# Altium schematic sheet FIT_TCM_LOGIC.SchDoc: FIT_PM12 board
size 420 x 297 mm; CheckedBy: G.Kasprowicz; Author: INR Moscow; CompanyName: WUT ISE; DrawnBy: M.Podgórski; Organization: WUT ISE; Address1: PW ISE; Address2: Nowowiejska 15/19 00-665 Warsaw; Address3: gkasprow@gmail.com; Revision: 2; SheetNumber: -; SheetTotal: -; ModifiedBy: -; CheckedDate: -; Title2: Title 2; DivGrp: WUT ISE; Designer: INR RAS; ModifiedDate: -; ProjectName: Sensor Box
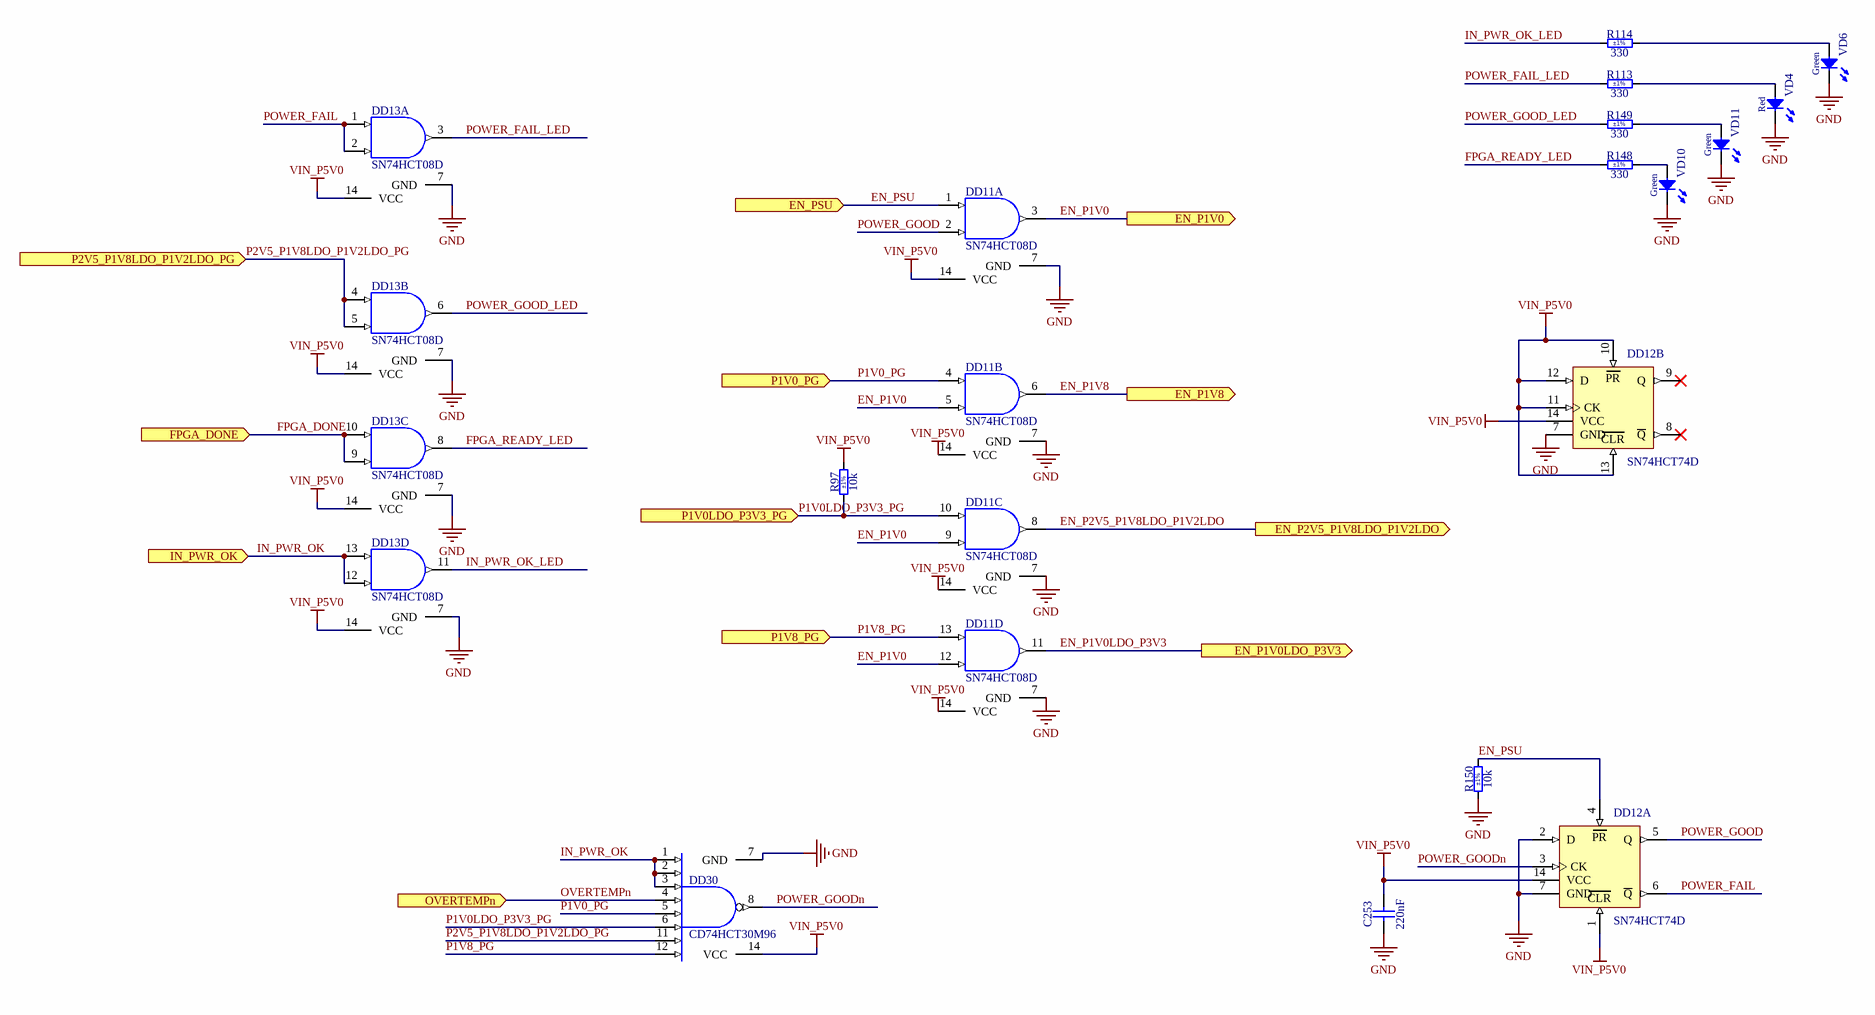
[diagram p0: FIT_TCM_LOGIC.SchDoc]

## Parts
C253  220nF  [CAPC2012X135N]
DD11  SN74HCT08D  [SOIC127P600X175-14N]  (parts A,B,C,D of 4)
DD12  SN74HCT74D  [SOIC127P600X175-14N]  (parts A,B of 2)
DD13  SN74HCT08D  [SOIC127P600X175-14N]  (parts A,B,C,D of 4)
DD30  CD74HCT30M96  [SOIC127P600X175-14N]
R97  10k  Tolerance: ±1%  [RESC2012X60N]
R113  330  Tolerance: ±1%  [RESC2012X60N]
R114  330  Tolerance: ±1%  [RESC2012X60N]
R148  330  Tolerance: ±1%  [RESC2012X60N]
R149  330  Tolerance: ±1%  [RESC2012X60N]
R150  10k  Tolerance: ±1%  [RESC2012X60N]
VD4  Red  [LED_KINGBRIGHT_KPT-2012SURCK]
VD6  Green  [LED_KINGBRIGHT_KP-2012LSGC]
VD10  Green  [LED_KINGBRIGHT_KP-2012LSGC]
VD11  Green  [LED_KINGBRIGHT_KP-2012LSGC]

## Ports
EN_P1V0 (out), EN_P1V0LDO_P3V3 (out), EN_P1V8 (out), EN_P2V5_P1V8LDO_P1V2LDO (out), EN_PSU (in), FPGA_DONE (in), IN_PWR_OK (in), OVERTEMPn (in), P1V0_PG (in), P1V0LDO_P3V3_PG (in), P1V8_PG (in), P2V5_P1V8LDO_P1V2LDO_PG (in)

## Nets
GND: C253.1 DD11.7(GND) DD12.2(D) DD12.7(GND) DD13.7(GND) DD30.7(GND) R150.1 VD4.1(C) VD6.1(C) VD10.1(C) VD11.1(C)
VIN_P5V0: C253.2 DD11.14(VCC) DD12.1(~{CLR}) DD12.10(~{PR}) DD12.11(CK) DD12.12(D) DD12.13(~{CLR}) DD12.14(VCC) DD13.14(VCC) DD30.14(VCC) R97.2
EN_P1V0: DD11.3(Y) DD11.5(B) DD11.9(B) DD11.12(B) ; port EN_P1V0
EN_P1V0LDO_P3V3: DD11.11(Y) ; port EN_P1V0LDO_P3V3
EN_P1V8: DD11.6(Y) ; port EN_P1V8
EN_P2V5_P1V8LDO_P1V2LDO: DD11.8(Y) ; port EN_P2V5_P1V8LDO_P1V2LDO
EN_PSU: DD11.1(A) DD12.4(~{PR}) R150.2 ; port EN_PSU
FPGA_DONE: DD13.9(B) DD13.10(A) ; port FPGA_DONE
FPGA_READY_LED: DD13.8(Y) R148.1
IN_PWR_OK: DD13.12(B) DD13.13(A) DD30.1(A) DD30.2(B) DD30.3(C) ; port IN_PWR_OK
IN_PWR_OK_LED: DD13.11(Y) R114.1
OVERTEMPn: DD30.4(D) ; port OVERTEMPn
P1V0_PG: DD11.4(A) DD30.5(E) ; port P1V0_PG
P1V0LDO_P3V3_PG: DD11.10(A) DD30.6(F) R97.1 ; port P1V0LDO_P3V3_PG
P1V8_PG: DD11.13(A) DD30.12(H) ; port P1V8_PG
P2V5_P1V8LDO_P1V2LDO_PG: DD13.4(A) DD13.5(B) DD30.11(G) ; port P2V5_P1V8LDO_P1V2LDO_PG
POWER_FAIL: DD12.6(~{Q}) DD13.1(A) DD13.2(B)
POWER_FAIL_LED: DD13.3(Y) R113.1
POWER_GOOD: DD11.2(B) DD12.5(Q)
POWER_GOOD_LED: DD13.6(Y) R149.1
POWER_GOODn: DD12.3(CK) DD30.8(Y)
NetR113_2: R113.2 VD4.2(A)
NetR114_2: R114.2 VD6.2(A)
NetR148_2: R148.2 VD10.2(A)
NetR149_2: R149.2 VD11.2(A)

Not connected (* = marked no-connect by the designer): DD12 8(~{Q})* 9(Q)*

## Notes on the sheet
- Project/Equipment
- Document
- Designer
- Drawn by
- Check.by
- Copyright WUT ISE 2024.
  This documentation describes Open Hardware and is licensed under the CERN OHL v.2. You may redistribute and modify this documentation under the terms of the CERN OHL v.2. (http://ohwr.org/CERNOHL). This documentation is distributed WITHOUT ANY EXPRESS OR IMPLIED WARRANTY, INCLUDING OF MERCHANTABILITY, SATISFACTORY QUALITY AND FITNESS FOR A PARTICULAR PURPOSE. Please see the CERN OHL v.2 for applicable conditions.
- Contact
- File
- Last Mod.
- Print Date
- Sheet
- Size
- A3
- of
- Rev
- (in symbol SN74HCT74D, part A) PR; CLR
- (in symbol SN74HCT74D, part B) PR; CLR

## Library data of the parts
C253 = CC0805_220NF_50V_10%_X7R: Non-polarised capacitor; Part Description: SMD Multilayer Chip Ceramic Capacitor; Manufacturer: GENERIC; Manufacturer1 Part Number: GRM21BR71H224KA01L; Voltage: 50V; TC: X7R; Tolerance: ±10%; Part Number: CC0805_220NF_50V_10%_X7R; Component Kind: Standard; Component Type: Standard; Pin Count: 2; Value: 220nF; Status: Preferred; Manufacturer Part Number: CC0805_220NF_50V_10%_X7R; Case: 0805; Mounted: Yes; Socket: No; SMD: Yes; Sense: No; Manufacturer1 Example: MURATA; Manufacturer1 ComponentHeight: 1.35mm; HelpURL: \\cern.ch\dfs\Applications\Altium\Datasheets\CC0805_X7R_MURATA.pdf; Author: CERN DEM JLC; CreateDate: 03.12.2007; LatestRevisionDate: 03.12.2007
DD11 DD13 = SN74HCT08D: Quad 2-Input AND Gate; Part Description: Quadruple 2-Input Positive-AND Gate; Manufacturer: TEXAS INSTRUMENTS; PressFit: No; Bonding: No; Part Number: SN74HCT08D; Component Kind: Standard; Component Type: Standard; Device: SN74HCT08D; PackageDescription: SOIC, 1.27mm Pitch; 14 Pin, 4.00mm W X 8.75mm L X 1.75mm H body, IPC Medium Density; Manufacturer Part Number: SN74HCT08D; Pin Count: 14; Case: SOIC14; Mounted: Yes; Socket: No; SMD: Yes; Sense: No; ComponentHeight: 1.75mm; Author: CERN DEM HF; HelpURL: \\cern.ch\dfs\Applications\Altium\Datasheets\SN74HCT08.pdf; CreateDate: 10.06.2024; LatestRevisionDate: 10.06.2024
DD12 = SN74HCT74D: Dual D-Type Flip Flop with Preset and Clear; Part Description: Dual Positive-Edge-Triggered D-Type Flip-Flop with Clear and Preset; Manufacturer: TEXAS INSTRUMENTS; PressFit: No; Bonding: No; Part Number: SN74HCT74D; Component Kind: Standard; Component Type: Standard; Device: SN74HCT74D; PackageDescription: SOIC 14, Pitch 1.27mm - Body 4x8.75mm, IPC Medium Density; Manufacturer Part Number: SN74HCT74D; Pin Count: 14; Case: SOIC14; Mounted: Yes; Socket: No; SMD: Yes; Sense: No; ComponentHeight: 1.75mm; Author: CERN DEM JLC; HelpURL: \\cern.ch\dfs\Applications\Altium\Datasheets\SN74HCT74D.pdf; CreateDate: 11.12.2018; LatestRevisionDate: 11.12.2018
DD30 = CD74HCT30M96: 8-Input NAND Gate; Manufacturer: TEXAS INSTRUMENTS; PressFit: No; Bonding: No; Part Number: CD74HCT30M96; Component Kind: Standard; Component Type: Standard; Device: CD74HCT30M96; PackageDescription: SOIC 14, Pitch 1.27mm - Body 4x8.75mm, IPC Medium Density; Part Description: 8-Input NAND Gate; Manufacturer Part Number: CD74HCT30M96; Pin Count: 14; Case: SOIC14; Mounted: Yes; Socket: Yes; SMD: Yes; Sense: No; ComponentHeight: 1.75mm; Author: CERN DEM HF; HelpURL: \\cern.ch\dfs\Applications\Altium\Datasheets\CD74HCT30M96.pdf; CreateDate: 31.05.2024; LatestRevisionDate: 31.05.2024
R97 R150 = R0805_10K_1%_0.125W_100PPM: Resistor - 1%; Part Description: General Purpose Thick Film Chip Resistor; Manufacturer: GENERIC; Manufacturer1 Part Number: NRC10F1002TRF; Power: 0.125W; TC: ±100ppm/°C; PressFit: No; Part Number: R0805_10K_1%_0.125W_100PPM; Component Kind: Standard; Component Type: Standard; Pin Count: 2; Value: 10k; Status: Preferred; Manufacturer Part Number: R0805_10K_1%_0.125W_100PPM; Case: 0805; Mounted: Yes; Sense: No; Socket: No; SMD: Yes; Manufacturer1 Example: NIC COMPONENT; Manufacturer1 ComponentHeight: 0.6mm; HelpURL: \\cern.ch\dfs\Applications\Altium\Datasheets\R0805_NIC_NRC.pdf; Author: CERN DEM JLC; CreateDate: 03.12.2007; LatestRevisionDate: 13.03.2008
R113 R114 R148 R149 = R0805_330R_1%_0.125W_100PPM: Resistor - 1%; Part Description: General Purpose Thick Film Chip Resistor; Manufacturer: GENERIC; Manufacturer1 Part Number: NRC10F3300TRF; Power: 0.125W; TC: ±100ppm/°C; PressFit: No; Part Number: R0805_330R_1%_0.125W_100PPM; Component Kind: Standard; Component Type: Standard; Pin Count: 2; Value: 330; Status: Preferred; Manufacturer Part Number: R0805_330R_1%_0.125W_100PPM; Case: 0805; Mounted: Yes; Sense: No; Socket: No; SMD: Yes; Manufacturer1 Example: NIC COMPONENT; Manufacturer1 ComponentHeight: 0.6mm; HelpURL: \\cern.ch\dfs\Applications\Altium\Datasheets\R0805_NIC_NRC.pdf; Author: CERN DEM JLC; CreateDate: 03.12.2007; LatestRevisionDate: 13.03.2008
VD4 = LED_KINGBRIGHT_KPT-2012SURCK: LED Red 1C 2A; Part Description: 2.0X1.25mm, SMD Hyper Red Chip LED Lamp, KPT-2012 Series; PressFit: No; Bonding: No; Part Number: LED_KINGBRIGHT_KPT-2012SURCK; Component Kind: Standard; Component Type: Standard; Color: Red; PackageDescription: SMT Hyper Red LED, Case 2012, Body L 2.00mm X  W 1.25mm X H 0.75mm; Manufacturer: KINGBRIGHT; Manufacturer Part Number: KPT-2012SURCK; Pin Count: 2; Case: 0805; Mounted: Yes; Socket: No; SMD: Yes; Sense: No; ComponentHeight: 0.75mm; HelpURL: \\cern.ch\dfs\Applications\Altium\Datasheets\LED_KINGBRIGHT_KPT-2012SURCK.pdf; Author: CERN DEM BC; CreateDate: 06.11.2020; LatestRevisionDate: 06.11.2020
VD6 VD10 VD11 = LED_KINGBRIGHT_KP-2012LSGC: LED Green 1C 2A; Part Description: 2.0x1.2mm Surface Mount Green LED; PressFit: No; Bonding: No; Part Number: LED_KINGBRIGHT_KP-2012LSGC; Component Kind: Standard; Component Type: Standard; Color: Green; PackageDescription: 2.0x1.2mm Surface Mount Green LED; Manufacturer: KINGBRIGHT; Manufacturer Part Number: KP-2012LSGC; Pin Count: 2; Case: 0805; Mounted: Yes; Socket: No; SMD: Yes; Sense: No; ComponentHeight: 1.1mm; HelpURL: \\cern.ch\dfs\Applications\Altium\Datasheets\LED_KINGBRIGHT_KP-2012LSGC.pdf; Author: CERN DEM BC; CreateDate: 09.11.2020; LatestRevisionDate: 09.11.2020